# Altium schematic sheet AVR.SchDoc
size A; SheetNumber: 5; SheetTotal: 12
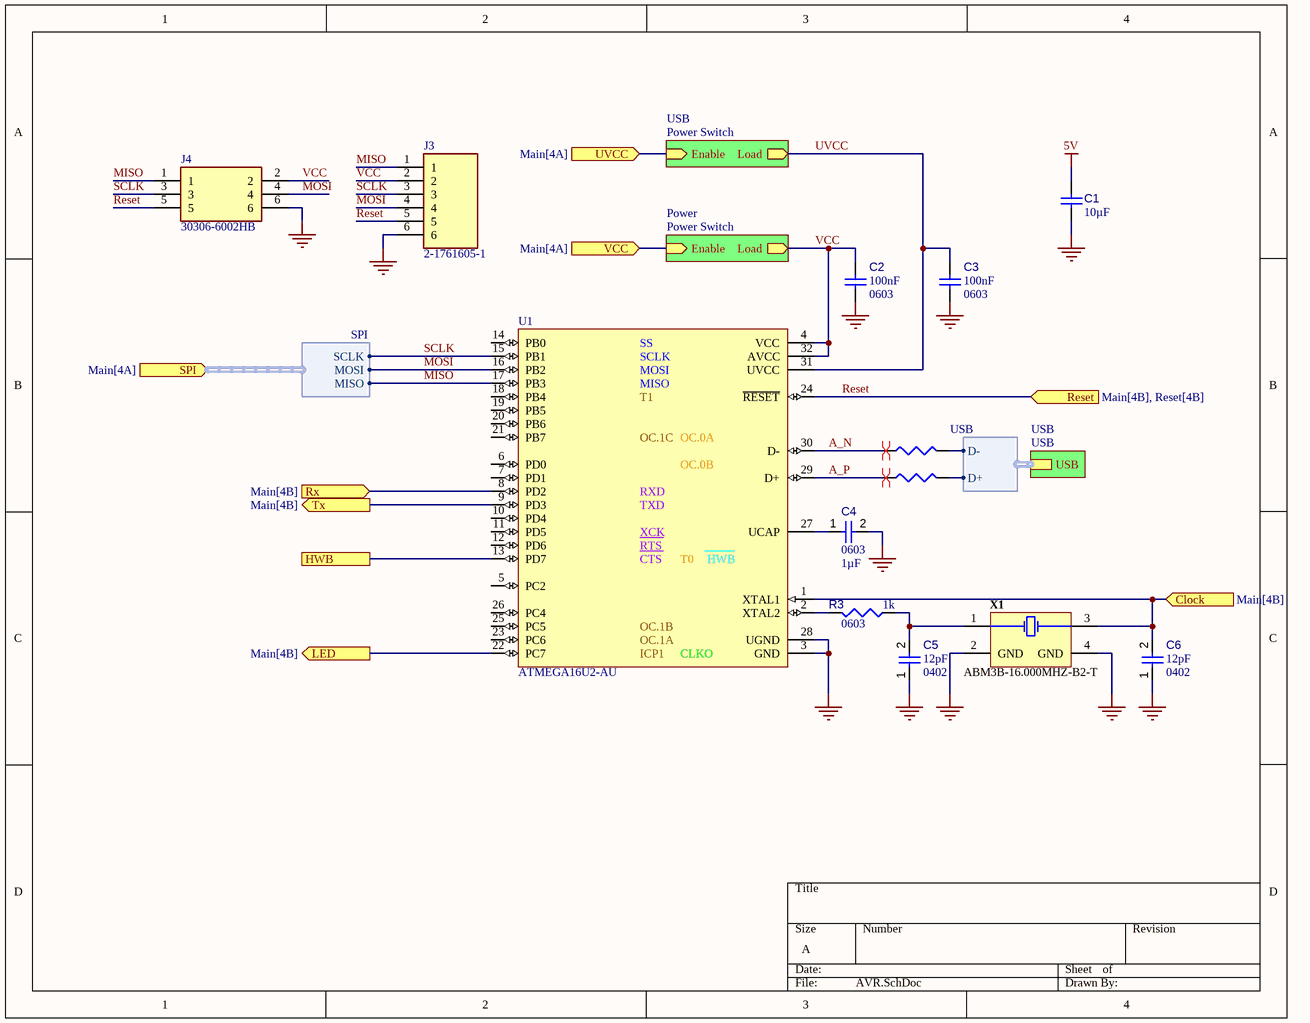
[diagram p0: AVR.SchDoc]

## Parts
C1  value 10µF  [CAPC2013X135X45NL10T25]  (hidden comment: Capacitor 10 uF +/- 10% 16 V 0805)
C2  value 100nF  Case/Package: 0603  [CAPC1608X90X40NL10T20]  (hidden comment: Capacitor 100 nF +/-10% 50 V 0603)
C3  value 100nF  Case/Package: 0603  [CAPC1608X90X40NL10T20]  (hidden comment: Capacitor 100 nF +/-10% 50 V 0603)
C4  value 1µF  Case/Package: 0603  [CAPC1608X90X35ML15T15]  (hidden comment: Capacitor 1uF +/- 10% 16V 0603)
C5  value 12pF  Case/Package: 0402  [CAPC0402(1005)33_L]  (hidden comment: Capacitor 12pF +/-10% 50V 0402)
C6  value 12pF  Case/Package: 0402  [CAPC0402(1005)33_L]  (hidden comment: Capacitor 12pF +/-10% 50V 0402)
J3  2-1761605-1  [TE_2-1761605-1]
J4  30306-6002HB  [3M_30306-6002HB]
R1  Resistor 22R +/-1% 0603 100 mW  [RESC1609X50X30ML08T20]  (value not drawn)
R2  Resistor 22R +/-1% 0603 100 mW  [RESC1609X50X30ML08T20]  (value not drawn)
R3  value 1k  Case/Package: 0603  [RESC1608X55X25ML10T15]  (hidden comment: Resistor 1k +/-1% 0603 100 mW)
U1  ATMEGA16U2-AU  [QFP80P900X900X120-32N]
X1  ABM3B-16.000MHZ-B2-T  [ABRA-ABM3B-4_V]

## Sub-sheets
Power = Power Switch: Enable (in), Load (out)
USB = Power Switch: Enable (in), Load (out)
USB = USB: USB (harness USB)

## Ports
Clock (in, see Main[4B]), HWB (see Main[4B]), LED (out, see Main[4B]), Reset (in, see Main[4B], Reset[4B]), Rx (in, see Main[4B]), SPI (in, harness SPI, see Main[4A]), Tx (out, see Main[4B]), UVCC (in, see Main[4A]), VCC (in, see Main[4A])

## Harnesses
USB: D-, D+
SPI: MISO, MOSI, SCLK

## Nets
5V: C1.1
GND: C1.2 C2.1 C3.1 C4.2 C5.1 C6.1 J3.6 J4.6 U1.3(GND) U1.28(UGND) X1.2(GND) X1.4(GND)
A_N: R1.2 U1.30(D-)
A_P: R2.2 U1.29(D+)
Clock: C6.2 U1.1(XTAL1) X1.3(X2) ; port Clock
HWB: U1.13(PD7) ; port HWB
LED: U1.22(PC7) ; port LED
MISO: J3.1 J4.1 U1.17(PB3) ; port SPI.MISO
MOSI: J3.4 J4.4 U1.16(PB2) ; port SPI.MOSI
Reset: J3.5 J4.5 U1.24(~{RESET}) ; port Reset
Rx: U1.8(PD2) ; port Rx
SCLK: J3.3 J4.3 U1.15(PB1) ; port SPI.SCLK
Tx: U1.9(PD3) ; port Tx
UVCC: C3.2 U1.31(UVCC) ; sheet USB/Load
UVCC: port UVCC, sheet USB/Enable  [a separate net that carries the same name]
VCC: C2.2 J3.2 J4.2 U1.4(VCC) U1.32(AVCC) ; sheet Power/Load
VCC: port VCC, sheet Power/Enable  [a separate net that carries the same name]
NetC4_1: C4.1 U1.27(UCAP)
NetC5_2: C5.2 R3.1 X1.1(X1)
NetR1_1: R1.1 ; sheet USB/USB.D-
NetR2_1: R2.1 ; sheet USB/USB.D+
NetR3_2: R3.2 U1.2(XTAL2)

Not connected (* = marked no-connect by the designer): U1 5(PC2) 6(PD0) 7(PD1) 10(PD4) 11(PD5) 12(PD6) 14(PB0) 18(PB4) 19(PB5) 20(PB6) 21(PB7) 23(PC6) 25(PC5) 26(PC4)

## Layout directives
differential pair: A_N, A_P

## Notes on the sheet
- (in symbol CMP-012-000000-3) SS; SCLK; MOSI; MISO; T1; OC.1C; OC.0A; OC.0B; RXD; TXD; XCK; ____; RTS; _____; CTS; T0; HWB; OC.1B; OC.1A; ICP1; CLKO

## Library data of the parts
C1 = CMP-001-00015-6: Chip Capacitor, 10 uF, +/- 10%, 16 V, 0805 (2012 Metric); Voltage Rating: 16V; Capacitor Type: Ceramic; RoHS Compliant: True; Max Operating Temperature: 85°C; Min Operating Temperature: -55°C; Mounting Technology: SM; Tolerance: 10%; Case/Package: 0805; Pins: 2
C2 C3 = CMP-001-00017-6: Chip Capacitor, 100 nF, +/- 10%, 50 V, 0603 (1608 Metric); Voltage Rating: 50V; Capacitor Type: Ceramic; Tolerance: 10%; Mounting Technology: SM; Max Operating Temperature: 125°C; RoHS Compliant: True; Pins: 2; Min Operating Temperature: -55°C
C4 = CMP-001-00004-6: Chip Capacitor, 1 uF, +/- 10%, 16 V, 0603 (1608 Metric); Capacitor Type: Ceramic; Mounting Technology: SM; RoHS Compliant: True; Min Operating Temperature: -55°C; Pins: 2; Voltage Rating: 16V; Max Operating Temperature: 125°C; Tolerance: 10%
C5 C6 = CMP-001-00072-4: Chip Capacitor, 12pF +/-10%, 50V, 0402, Thickness 0.33 mm; Tolerance: 20%; Pins: 2; Max Operating Temperature: 85°C; Voltage Rating: 50V; Mounting Technology: SMT; Min Operating Temperature: -55°C
J3 = CMP-014-000000-2: Wire-To-Board Connector, AMP-LATCH Series, Through Hole, Header, 6, 2.54 mm, Gold Plated Contacts; MF: TE Connectivity; Source: SnapEDAsch.SchLib; Package: None; Price: None; Value: *; SnapEDA_Link: https://www.snapeda.com/parts/2-1761605-1/TE%20Connectivity%20AMP%20Connectors/view-part/2778412/?ref=snap; Pin Count: 6; Component Type: Standard; Design Item ID: 2-1761605-1; Availability: Unavailable; MP: 2-1761605-1
J4 = CMP-024-000000-2: Connector Header Through Hole 6 position 0.100 _2.54mm_; MF: 3M; Source: SnapEDAsch.SchLib; Design Item ID: 30306-6002HB; Pin Count: 6; Component Type: Standard; Price: None; SnapEDA_Link: https://www.snapeda.com/parts/30306-6002HB/3M%20%28TC%29/view-part/542808/?ref=snap; Availability: Unavailable; MP: 30306-6002HB; Value: *; Package: None
R1 R2 = CMP-009-00027-5: Chip Resistor, 22 Ohm, +/- 1%, 100 mW, -55 to 155 degC, 0603 (1608 Metric); Power: 100mW; Voltage Rating: 75V; Value: 22; Max Operating Temperature: 155°C; Min Operating Temperature: -55°C; Tolerance: 1%; RoHS Compliant: True; Mounting Technology: SM; Case/Package: 0603; Pins: 2
R3 = CMP-009-00014-5: Chip Resistor, 1 KOhm, +/-1%, 0.1 W, -55 to 155 degC, 0603 (1608 Metric); Voltage Rating: 50V; Power: 100mW; Tolerance: 1%; Mounting Technology: SM; Pins: 2; Min Operating Temperature: -55°C; RoHS Compliant: True; Max Operating Temperature: 155°C
U1 = CMP-012-000000-3: AVR AVR® ATmega Microcontroller IC 8-Bit 16MHz 16KB FLASH 32-TQFP 7x7; MF: Microchip; SnapEDA_Link: https://www.snapeda.com/parts/ATMEGA16U2-AU/Microchip/view-part/589119/?ref=snap; Value: *; MP: ATMEGA16U2-AU; Digi-Key_Purchase_URL: https://www.digikey.com.tr/product-detail/en/microchip-technology/ATMEGA16U2-AU/ATMEGA16U2-AU-ND/2050947?utm_source=snapeda&utm_medium=aggregator&utm_campaign=symbol; Package: TQFP-32 Microchip; Pin Count: 32; Digi-Key_Part_Number: ATMEGA16U2-AU-ND; Design Item ID: ATMEGA16U2-AU; Source: SnapEDAsch.SchLib; Component Type: Standard
X1 = CMP-003-00017-2: Ceramic SMD Crystal, 16 MHz, +/- 20 ppm, 18 pF, -20 to 70 degC, 4-Pin SMD, RoHS, Tape and Reel; Manufacturer: Abracon; Tolerance: 20ppm; Load Capacitance: 18pF; Frequency: 16MHz; Resistance: 50Ohm; ESR: 50; Max Operating Temperature: 70°C; Frequency Tolerance: 20ppm; Min Operating Temperature: -20°C; Packaging: TapeandReel; Manufacturer URL: http://www.abracon.com/; Package Quantity: 1000; Datasheet URL: http://www.abracon.com/Resonators/abm3b.pdf; Package Description: 4-Pin Surface Mount Device, Body 5 x 3.2 mm; Pins: 4; Package Reference: ABM3B; Datasheet Version: Aug-15; Case/Package: CSMD; Mounting Technology: SM; RoHS Compliant: True